# EasyEDA Pro project Loongson_Continuation.epro, board PCB1
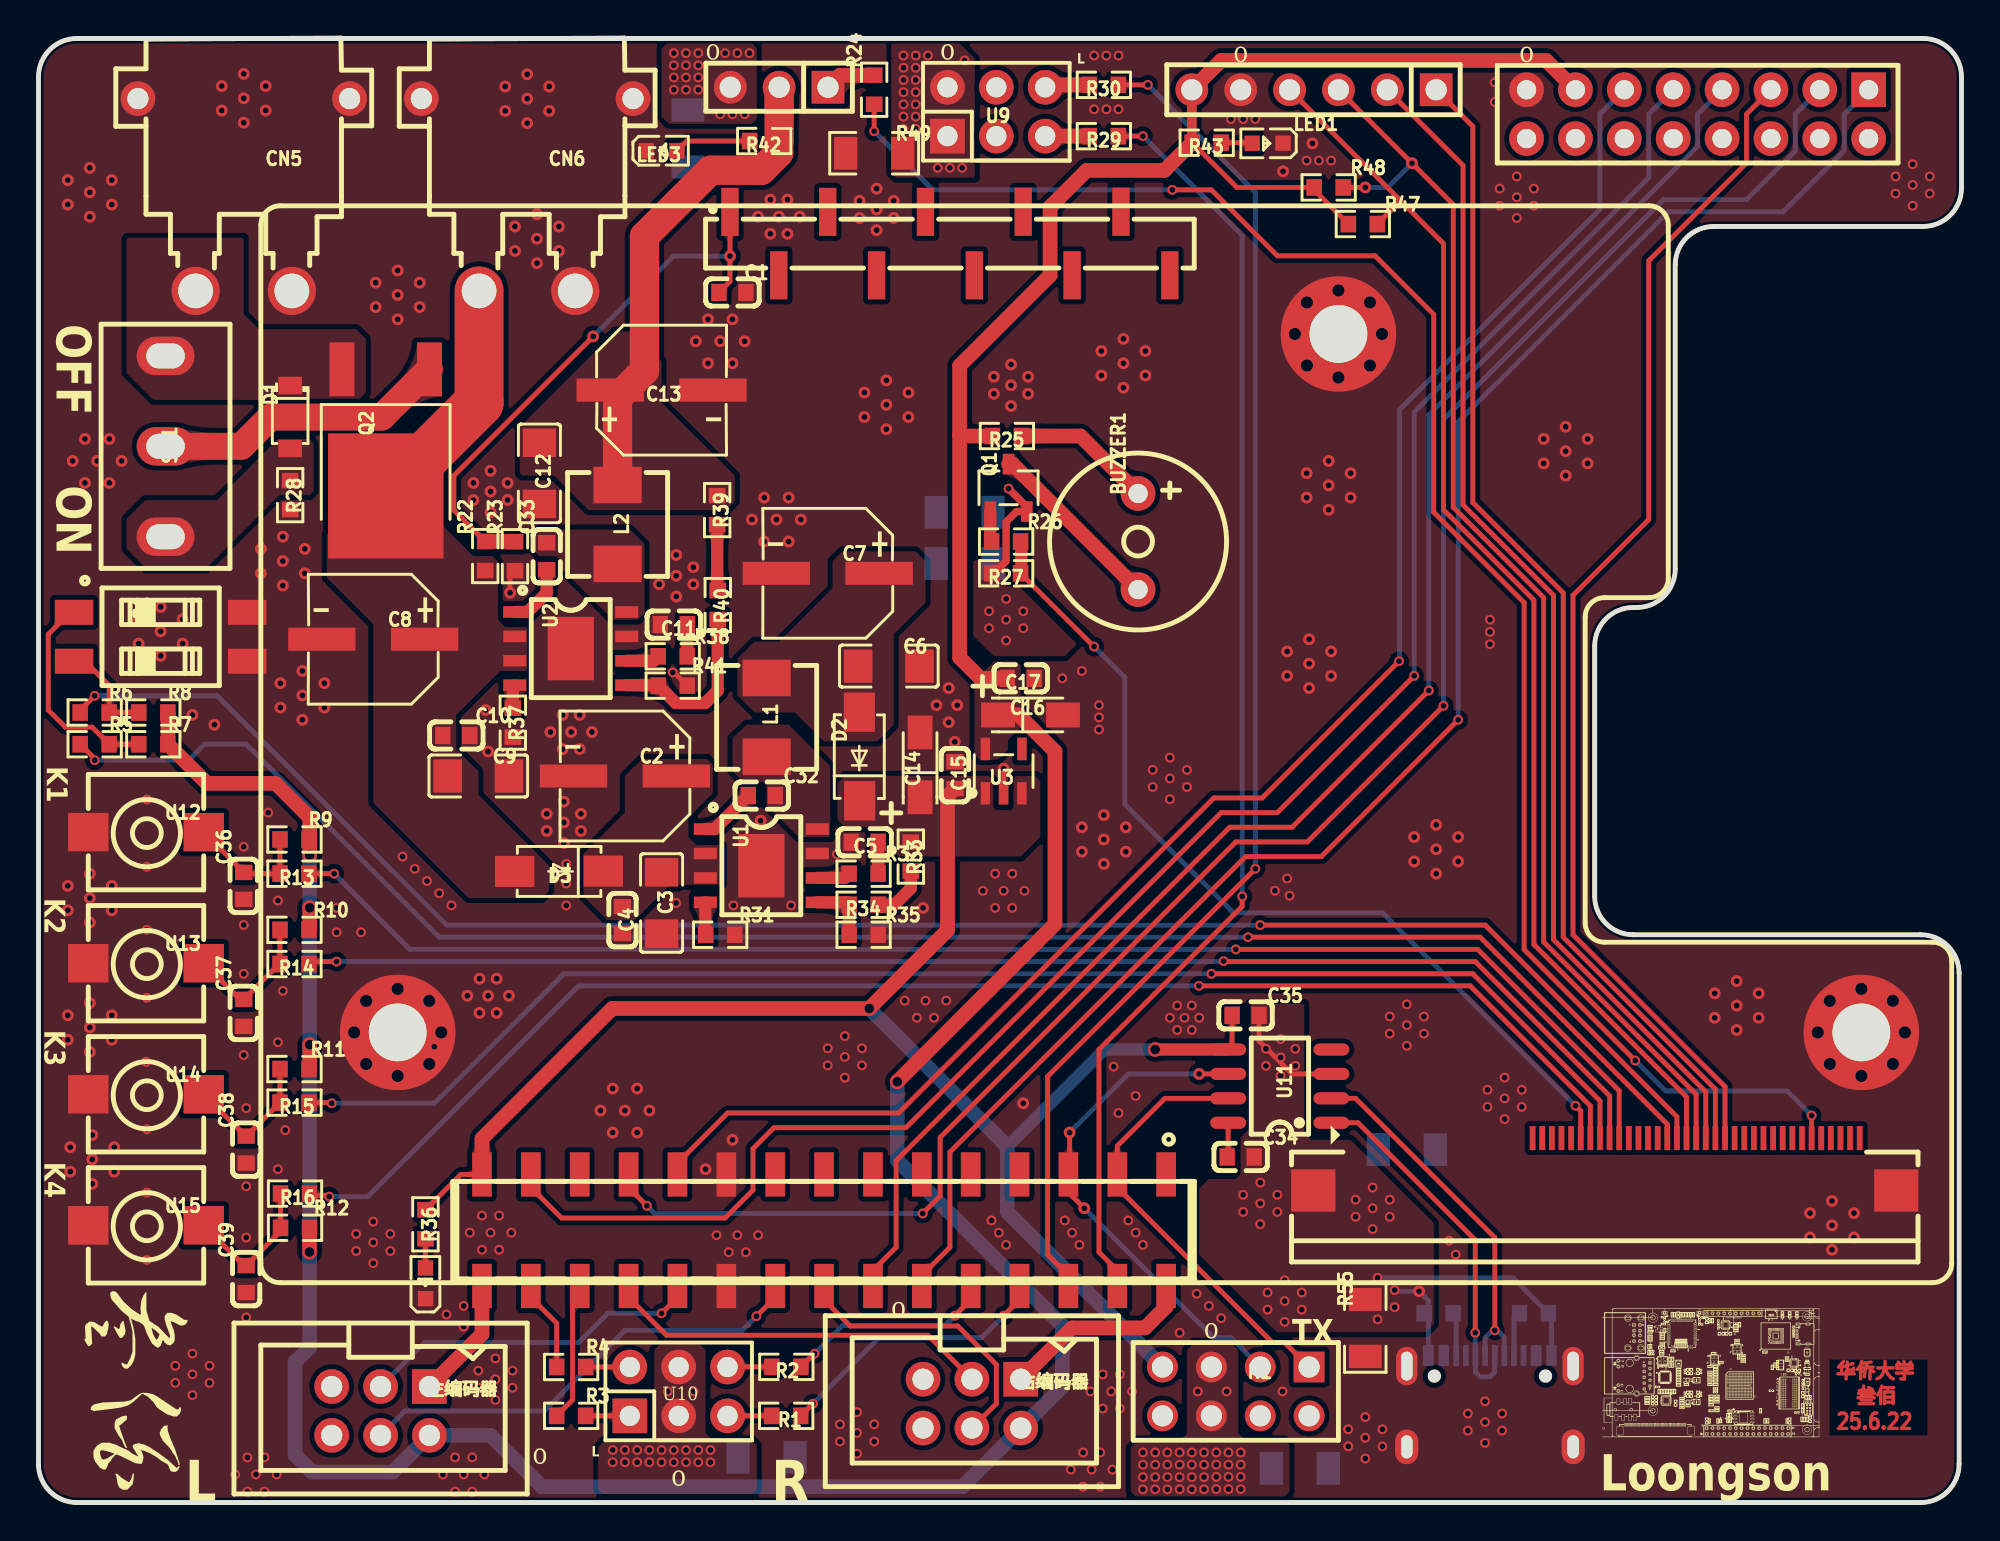
[diagram p2: board, top side]
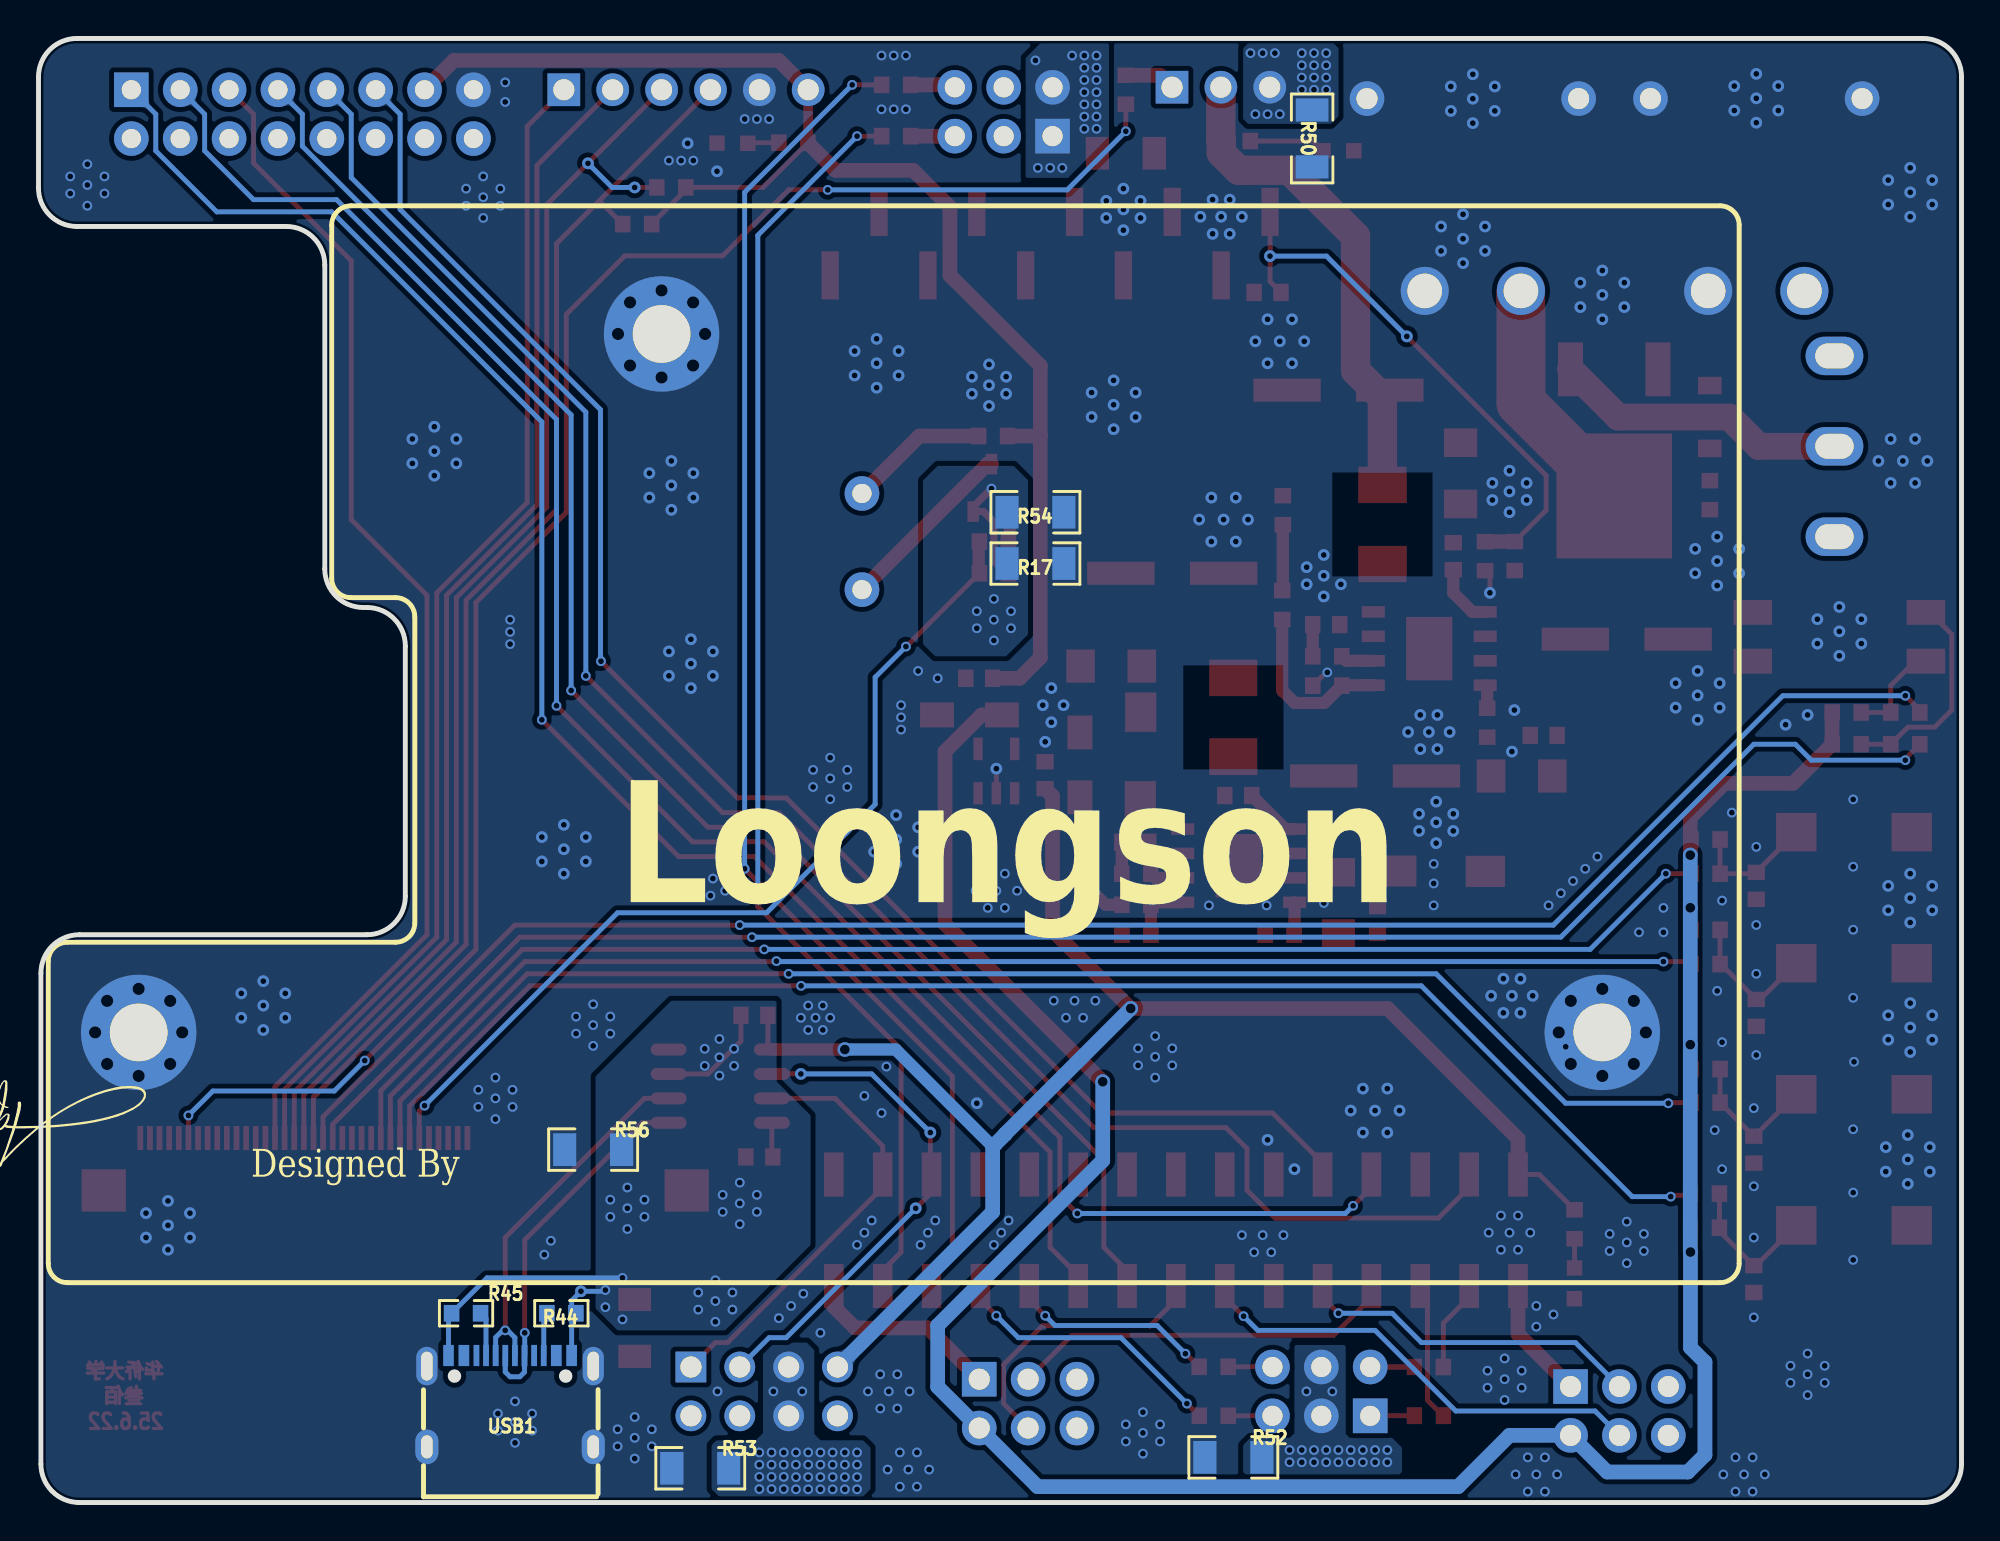
[diagram p3: board, bottom side, seen from below]

Outline 99.95 x 76.14 mm; copper layers: Top Layer, Bottom Layer. Coordinates in mm from the lower left corner of the outline.
Outline path: 0,74.14 arc(0.59,75.55) 2,76.14 97.95,76.14 arc(99.36,75.55) 99.95,74.14 99.95,68.36 arc(99.36,66.95) 97.95,66.36 87.07,66.36 arc(85.65,65.77) 85.07,64.36 85.07,48.55 arc(84.48,47.13) 83.07,46.55 82.88,46.55 arc(81.47,45.96) 80.88,44.55 80.88,31.53 arc(81.47,30.11) 82.88,29.53 97.82,29.53 arc(99.24,28.94) 99.82,27.53 99.82,2 arc(99.24,0.59) 97.82,0 2,0 arc(0.59,0.59) 0,2 0,74.14
Stack: Top Layer 0.035mm / Dielectric1 1.51mm FR4 er 4.5 / Bottom Layer 0.035mm

## Design rules (mm)
template: 自定义配置
spacing copperThickness1oz (default): track to track 0.102, other pairs 0.152 to 0.3
spacing copperThickness2oz: track to track 0.203, other pairs 0.152 to 0.3
track width copperThickness1oz (default): min 0.127, default 0.254, max 2.54
track width copperThickness2oz: min 0.203, default 0.254, max 2.54
differential pair differentialPair (default): width min 0.127, default 0.254, max 2.54; gap min 0.152, default 0.152
via viaSize (default): diameter min 0.5, default 0.61, max 10; hole min 0.3, default 0.305, max 6.3

## Placement (name value [footprint] x y rotation side)
BUZZER1  3kHz  [BUZ-TH_BD9.0-P5.00-D0.6-FD]  57.15 49.98 270 top
C1  100nF  [C0603]  36.07 62.93 180 top
C2  100uF  [CAP-SMD_BD6.3-L6.6-W6.6-LS7.6-FD]  30.48 37.78 180 top
C3  4.7uF  [C1206]  32.39 31.18 90 top
C4  100nF  [C0603]  30.35 30.29 90 top
C5  4.7nF  [C0603]  42.94 34.34 0 top
C6  47uF  [C1206]  44.2 43.5 180 top
C7  220uF  [CAP-SMD_BD6.3-L6.6-W6.6-LS7.4-FD]  41.02 48.32 180 top
C8  100uF  [CAP-SMD_BD6.3-L6.6-W6.6-LS7.6-FD]  17.4 44.9 180 top
C9  4.7uF  [C1206]  22.86 37.78 180 top
C10  100nF  [C0603]  21.72 39.89 180 top
C11  4.7nF  [C0603]  33.02 45.66 0 top
C12  47uF  [C1206]  26.04 53.52 90 top
C13  220uF  [CAP-SMD_BD6.3-L6.6-W6.6-LS7.4-FD]  32.39 57.85 0 top
C14  10uF  [CAP-SMD_L3.2-W1.6-RD-C7171]  45.82 38.36 90 top
C15  100nF  [C0603]  47.64 37.83 90 top
C16  10uF  [CAP-SMD_L3.2-W1.6-RD-C7171]  51.56 40.96 0 top
C17  100nF  [C0603]  51.05 42.86 0 top
C32  100nF  [C0603]  37.59 36.77 180 top
C33  100nF  [C0603]  26.42 49.21 270 top
C34  100nF  [C0603]  62.48 17.97 180 top
C35  100nF  [C0603]  62.74 25.34 180 top
C36  100nF  [C0603]  10.67 32.07 270 top
C37  100nF  [C0603]  10.67 25.46 270 top
C38  100nF  [C0603]  10.8 18.35 270 top
C39  100nF  [C0603]  10.8 11.62 270 top
CH1  HC-PM254-8.5H-2x15PS  [HDR-SMD_30P-P2.54-V-F-R2-C15-LS7.1-1]  40.83 14.16 180 top
CH2  HX PM2.54-1x10P TP-YQ  [HDR-SMD_10P-P2.54-V-F-LS4.7_R2]  47.37 65.47 0 top
CN5  XT30PW-M30.G.Y  [CONN-TH_XT30PW-M]  10.67 68.01 180 top
CN6  XT30PW-M30.G.Y  [CONN-TH_XT30PW-M]  25.4 68.01 180 top
D1  BZT52C16  [SOD-123_L2.7-W1.6-LS3.7-RD]  13.08 56.45 270 top
D2  SS54  [SMA_L4.3-W2.6-LS5.0-FD]  42.67 38.8 270 top
D3  SS54  [SMA_L4.3-W2.6-LS5.0-FD]  27.05 32.83 0 top
H1  PM254V-12-08-H85  [HDR-TH_8P-P2.54-V-F-R2-C4-S2.54]  62.23 5.78 180 top
L1  4.7uH  [IND-SMD_L5.4-W5.2_FXL0530]  37.85 40.83 90 top
L2  4.7uH  [IND-SMD_L5.4-W5.2_FXL0530]  30.1 50.86 90 top
LED1  NCD0603R1  [LED0603-RD_RED]  63.88 70.69 180 top
LED2  NCD0603R1  [LED0603-RD_RED]  20.12 11.4 90 top
LED3  NCD0603B1  [LED0603-RD]  32.39 70.3 0 top
NOREF  -  [Pad_e2196]  67.56 60.77 0 top
NOREF#2  -  [Pad_e2198]  18.67 24.45 0 top
NOREF#3  -  [Pad_e2197]  94.74 24.45 0 top
Q1  S8050  [SOT-23-3_L2.9-W1.6-P1.90-LS2.8-BR]  50.42 52.77 270 top
Q2  HY19P03D  [TO-252-2_L6.6-W6.1-P4.57-LS9.9-TL-CW]  18.05 55.64 270 top
R1  100Ω  [R0603]  38.86 4.51 0 top
R2  100Ω  [R0603]  38.87 7.06 0 top
R3  100Ω  [R0603]  27.69 4.51 180 top
R4  100Ω  [R0603]  27.69 7.05 180 top
R5  470Ω  [R0603]  2.92 39.43 180 top
R6  470Ω  [R0603]  2.92 41.09 180 top
R7  4.7kΩ  [R0603]  5.97 39.43 180 top
R8  4.7kΩ  [R0603]  5.97 41.09 180 top
R9  4.7kΩ  [R0603]  13.31 34.48 180 top
R10  4.7kΩ  [R0603]  13.31 29.78 180 top
R11  4.7kΩ  [R0603]  13.31 22.54 180 top
R12  4.7kΩ  [R0603]  13.34 14.29 180 top
R13  100Ω  [R0603]  13.31 32.7 0 top
R14  100Ω  [R0603]  13.31 28 0 top
R15  100Ω  [R0603]  13.31 20.8 0 top
R16  100Ω  [R0603]  13.34 16.07 0 top
R17  0Ω  [R1206]  48.13 48.83 180 bottom
R22  200kΩ  [R0603]  23.22 49.22 270 top
R23  20kΩ  [R0603]  24.77 49.21 270 top
R24  100Ω  [R0603]  43.43 73.47 270 top
R25  10Ω  [R0603]  50.33 55.46 0 top
R26  4.7kΩ  [R0603]  50.29 49.98 180 top
R27  10kΩ  [R0603]  50.29 48.32 0 top
R28  10kΩ  [R0603]  13.08 52.39 90 top
R29  100Ω  [R0603]  55.37 71.06 0 top
R30  100Ω  [R0603]  55.37 73.72 0 top
R31  200kΩ  [R0603]  35.43 29.53 180 top
R32  20kΩ  [R0603]  42.89 32.7 180 top
R33  51kΩ  [R0603]  45.34 33.59 90 top
R34  1.5kΩ  [R0603]  42.89 31.09 0 top
R35  10kΩ  [R0603]  42.89 29.53 180 top
R36  4.7kΩ  [R0603]  20.11 14.47 90 top
R37  200kΩ  [R0603]  24.65 40.56 90 top
R38  20kΩ  [R0603]  32.96 44.01 180 top
R39  27kΩ  [R0603]  35.27 51.61 90 top
R40  27kΩ  [R0603]  35.31 46.67 90 top
R41  7.5kΩ  [R0603]  32.96 42.48 180 top
R42  10kΩ  [R0603]  37.72 70.8 0 top
R43  2.7kΩ  [R0603]  60.72 70.72 0 top
R44  5.1kΩ  [R0603]  72.77 9.84 180 bottom
R45  5.1kΩ  [R0603]  77.72 9.84 0 bottom
R47  4.7kΩ  [R0603]  68.83 66.49 180 top
R48  4.7kΩ  [R0603]  67.06 68.39 180 top
R49  0Ω  [R1206]  43.43 70.17 180 top
R50  0Ω  [R1206]  33.75 70.94 270 bottom
R52  0Ω  [R1206]  37.85 2.35 0 bottom
R53  0Ω  [R1206]  65.55 1.78 0 bottom
R54  0Ω  [R1206]  48.13 51.5 180 bottom
R55  0Ω  [R1206]  68.96 9.08 270 top
R56  0Ω  [R1206]  71.12 18.35 0 bottom
S1  DSIC02LS-P  [SW-SMD_4P-L5.1-W6.1-P2.54-LS9.8]  6.35 45.02 270 top
SW1  SS-12D10L5  [SW-TH_SS-12D10L5]  6.6 54.93 90 top
U1  SCT2450STER  [ESOP-8_L4.9-W3.9-P1.27-LS6.0-BL-EP]  37.57 33.12 270 top
U2  SCT2450STER  [ESOP-8_L4.9-W3.9-P1.27-LS6.0-BL-EP]  27.66 44.41 270 top
U3  RT9013-33GB  [SOT-23-5_L3.0-W1.7-P0.95-LS2.8-BL]  50.17 38.04 0 top
U8  AFD01-S54FCC-00  [FPC-SMD_54P-P0.50_AFD01-S54FCA-00]  81.41 17.59 180 top
U9  ZX-PZ2.54-2-3PZZ  [HDR-TH_6P-P2.54-V-M-R2-C3-S2.54-1]  49.78 72.33 0 top
U10  ZX-PZ2.54-2-3PZZ  [HDR-TH_6P-P2.54-V-M-R2-C3-S2.54-1]  33.27 5.78 0 top
U11  CH340N  [SOP-8_L4.9-W3.9-P1.27-LS6.0-BL]  64.52 21.65 90 top
U12  SKPMAQE010  [KEY-SMD_2P-L6.0-W6.0-P6.00]  5.59 34.86 180 top
U13  SKPMAQE010  [KEY-SMD_2P-L6.0-W6.0-P6.00]  5.59 28.05 180 top
U14  SKPMAQE010  [KEY-SMD_2P-L6.0-W6.0-P6.00]  5.59 21.23 180 top
U15  SKPMAQE010  [KEY-SMD_2P-L6.0-W6.0-P6.00]  5.59 14.42 180 top
USB1  TYPE-C 16PIN 2MD(073)  [USB-C-SMD_TYPE-C-6PIN-2MD-073]  75.44 5.27 180 bottom
右编码器  BH254V-6P  [IDC-TH_6P-P2.54-V-R2-C3-S2.54]  48.51 5.14 180 top
屏幕1  PM254-2-08-Z-8.5  [HDR-TH_16P-P2.54-V-F-R2-C8-S2.54]  86.23 72.2 180 top
左编码器  BH254V-6P  [IDC-TH_6P-P2.54-V-R2-C3-S2.54]  17.78 4.76 180 top
舵机1  PZ254V-11-03P  [HDR-TH_3P-P2.54-V-M]  38.49 73.6 180 top
陀螺仪1  PZ254V-11-06P  [HDR-TH_6P-P2.54-V-M]  66.29 73.47 180 top

## Footprints (pads in the part's own frame, mm; a bottom-side part is the same pattern mirrored in y, then rotated)
BUZ-TH_BD9.0-P5.00-D0.6-FD
  round 1.8 hole 1: 1(-2.5,0) 2(2.5,0)
C0603
  rect 0.8x0.9 smd: 1(-0.7,0) 2(0.7,0)
C1206
  rect 1.485x1.728 smd: 1(-1.593,0) 2(1.593,0)
CAP-SMD_BD6.3-L6.6-W6.6-LS7.4-FD
  rect 3.5x1.2 smd: 1(-2.67,0) 2(2.67,0)
CAP-SMD_BD6.3-L6.6-W6.6-LS7.6-FD
  rect 3.5x1.2 smd: 1(-2.67,0) 2(2.67,0)
CAP-SMD_L3.2-W1.6-RD-C7171
  rect 1.758x1.296 smd: 1(-1.687,0) 2(1.687,0)
CONN-TH_XT30PW-M
  round 2.5 hole 1.8: 1(-2.5,5) 2(2.5,5)
  round 1.8 hole 1.1: 3(5.5,-5) 4(-5.5,-5)
ESOP-8_L4.9-W3.9-P1.27-LS6.0-BL-EP
  rect 0.6x1.2 smd: 1(-1.905,-2.909) 2(-0.635,-2.909) 3(0.635,-2.909) 4(1.905,-2.909) 5(1.905,2.909) 6(0.635,2.909) 7(-0.635,2.909) 8(-1.905,2.909)
  rect 3.3x2.4 smd: 9(0,0)
FPC-SMD_54P-P0.50_AFD01-S54FCA-00
  rect 0.3x1.25 smd: 20(3.75,-1.363) 21(3.25,-1.363) 22(2.75,-1.363) 23(2.25,-1.363) 24(1.75,-1.363) 25(1.25,-1.363) 26(0.75,-1.363) 27(0.25,-1.363) 28(-0.25,-1.363) 29(-0.75,-1.363) 30(-1.25,-1.363) 31(-1.75,-1.363) 32(-2.25,-1.363) 33(-2.75,-1.363) 34(-3.25,-1.363) 35(-3.75,-1.363) 36(-4.25,-1.363) 37(-4.75,-1.363) 38(-5.25,-1.363) 39(-5.75,-1.363) 40(-6.25,-1.363) 41(-6.75,-1.363) 42(-7.25,-1.363) 43(-7.75,-1.363) 44(-8.25,-1.363) 45(-8.75,-1.363) 46(-9.25,-1.363) 47(-9.75,-1.363) 48(-10.25,-1.363) 49(-10.75,-1.363) 50(-11.25,-1.363) 51(-11.75,-1.363) 52(-12.25,-1.363) 53(-12.75,-1.363) 54(-13.25,-1.363)
  rect 2.3x2.2 smd: 55(-15.15,1.363) 56(15.15,1.363)
HDR-SMD_10P-P2.54-V-F-LS4.7_R2
  rect 0.9x2.5 smd: 1(-11.43,1.65) 2(-8.89,-1.65) 3(-6.35,1.65) 4(-3.81,-1.65) 5(-1.27,1.65) 6(1.27,-1.65) 7(3.81,1.65) 8(6.35,-1.65) 9(8.89,1.65) 10(11.43,-1.65)
HDR-SMD_30P-P2.54-V-F-R2-C15-LS7.1-1
  rect 1.02x2.3 smd: 1(-17.78,-2.9) 2(-17.78,2.9) 3(-15.24,-2.9) 4(-15.24,2.9) 5(-12.7,-2.9) 6(-12.7,2.9) 7(-10.16,-2.9) 8(-10.16,2.9) 9(-7.62,-2.9) 10(-7.62,2.9) 11(-5.08,-2.9) 12(-5.08,2.9) 13(-2.54,-2.9) 14(-2.54,2.9) 15(0,-2.9) 16(0,2.9) 17(2.54,-2.9) 18(2.54,2.9) 19(5.08,-2.9) 20(5.08,2.9) 21(7.62,-2.9) 22(7.62,2.9) 23(10.16,-2.9) 24(10.16,2.9) 25(12.7,-2.9) 26(12.7,2.9) 27(15.24,-2.9) 28(15.24,2.9) 29(17.78,-2.9) 30(17.78,2.9)
HDR-TH_3P-P2.54-V-M
  rect 1.7x1.7 hole 1.1: 1(-2.54,0)
  round 1.7 hole 1.1: 2(0,0) 3(2.54,0)
HDR-TH_6P-P2.54-V-M
  rect 1.7x1.7 hole 1.1: 1(-6.35,0)
  round 1.7 hole 1.1: 2(-3.81,0) 3(-1.27,0) 4(1.27,0) 5(3.81,0) 6(6.35,0)
HDR-TH_6P-P2.54-V-M-R2-C3-S2.54-1
  rect 1.8x1.8 hole 1.05: 1(-2.54,-1.27)
  round 1.8 hole 1.05: 2(-2.54,1.27) 3(0,-1.27) 4(0,1.27) 5(2.54,-1.27) 6(2.54,1.27)
HDR-TH_8P-P2.54-V-F-R2-C4-S2.54
  rect 1.6x1.6 hole 1.1: 1(-3.81,-1.27)
  round 1.6 hole 1.1: 2(-3.81,1.27) 3(-1.27,-1.27) 4(-1.27,1.27) 5(1.27,-1.27) 6(1.27,1.27) 7(3.81,-1.27) 8(3.81,1.27)
HDR-TH_16P-P2.54-V-F-R2-C8-S2.54
  rect 1.8x1.8 hole 1: 1(-8.89,-1.27)
  round 1.8 hole 1: 2(-8.89,1.27) 3(-6.35,-1.27) 4(-6.35,1.27) 5(-3.81,-1.27) 6(-3.81,1.27) 7(-1.27,-1.27) 8(-1.27,1.27) 9(1.27,-1.27) 10(1.27,1.27) 11(3.81,-1.27) 12(3.81,1.27) 13(6.35,-1.27) 14(6.35,1.27) 15(8.89,-1.27) 16(8.89,1.27)
IDC-TH_6P-P2.54-V-R2-C3-S2.54
  rect 1.8x1.8 hole 1.1: 1(-2.54,-1.27)
  round 1.8 hole 1.1: 2(-2.54,1.27) 3(0,-1.27) 4(0,1.27) 5(2.54,-1.27) 6(2.54,1.27)
IND-SMD_L5.4-W5.2_FXL0530
  rect 1.9x2.5 smd: 1(-2.05,0) 2(2.05,0)
KEY-SMD_2P-L6.0-W6.0-P6.00
  rect 2.1x2 smd: 1(-3,0) 2(3,0)
LED0603-RD
  rect 0.8x0.8 smd: 1(-0.799,0) 2(0.799,0)
LED0603-RD_RED
  rect 0.8x0.8 smd: 1(-0.799,-0.004) 2(0.799,0.004)
Pad_e2196
  round 6 hole 3: 1(0,0)
Pad_e2197
  round 6 hole 3: 1(0,0)
Pad_e2198
  round 6 hole 3: 1(0,0)
R0603
  rect 0.806x0.864 smd: 1(-0.753,0) 2(0.753,0)
R1206
  rect 1.208x1.701 smd: 1(-1.479,0) 2(1.479,0)
SMA_L4.3-W2.6-LS5.0-FD
  rect 2.046x1.62 smd: 1(-2.304,-0.009) 2(2.304,0.009)
SOD-123_L2.7-W1.6-LS3.7-RD
  rect 0.91x1.22 smd: 1(-1.635,0) 2(1.635,0)
SOP-8_L4.9-W3.9-P1.27-LS6.0-BL
  oval 0.63x1.865 smd: 1(-1.905,-2.683) 2(-0.635,-2.683) 3(0.635,-2.683) 4(1.905,-2.683) 5(1.905,2.683) 6(0.635,2.683) 7(-0.635,2.683) 8(-1.905,2.683)
SOT-23-3_L2.9-W1.6-P1.90-LS2.8-BR
  rect 1.07x0.6 smd: 1(1.235,-0.95) 2(1.235,0.95) 3(-1.235,0)
SOT-23-5_L3.0-W1.7-P0.95-LS2.8-BL
  rect 0.49x1.157 smd: 1(-0.95,-1.153) 2(0,-1.153) 3(0.95,-1.153)
  rect 0.49x1.175 smd: 4(0.95,1.153) 5(-0.95,1.153)
SW-SMD_4P-L5.1-W6.1-P2.54-LS9.8
  rect 1.3x2 smd: 1(-1.27,-4.5) 2(1.27,-4.5) 3(1.27,4.5) 4(-1.27,4.5)
SW-TH_SS-12D10L5
  oval 2x3 hole 1.3x2: 1(-4.7,0) 2(0,0) 3(4.7,0)
TO-252-2_L6.6-W6.1-P4.57-LS9.9-TL-CW
  rect 2.8x1.3 smd: 1(-3.292,2.273) 3(-3.292,-2.273)
  rect 6.5x6 smd: 2(3.292,0)
USB-C-SMD_TYPE-C-6PIN-2MD-073
  rect 0.55x1.1 smd: 1(-3.2,2.375) 2(-2.4,2.375) 11(2.4,2.375) 12(3.2,2.375)
  rect 0.3x1.1 smd: 3(-1.75,2.375) 4(-1.25,2.375) 5(-0.75,2.375) 6(-0.25,2.375) 7(0.25,2.375) 8(0.75,2.375) 9(1.25,2.375) 10(1.75,2.375)
  oval 1.2x1.8 hole 0.6x1.2: 13(-4.325,-2.375) 14(4.325,-2.375)
  oval 1.1x2 hole 0.6x1.5: 13(-4.325,1.825) 14(4.325,1.825)

## Nets
As in the schematic, except:
GND: C1.1 C2.2 C3.1 C4.1 C5.1 C6.1 C7.2 C8.2 C9.1 C10.1 C11.1 C12.1 C13.2 C14.2 C15.2 C16.2 C17.2 C36.2 C37.2 C38.2 C39.2 CH1.19 CH1.20 CN5.1 CN5.3 CN5.4 CN6.1 CN6.3 CN6.4 LED1.1 LED2.1 LED3.1 NOREF.1 NOREF#2.1 NOREF#3.1 R17.2 R23.2 R28.1 R31.1 R35.1 R37.1 R41.1 R49.2 R50.2 R52.2 R53.2 R54.2 R55.2 R56.2 S1.3 S1.4 U1.7 U1.9 U2.7 U2.9 U3.2 U8.55 U12.2 U13.2 U14.2 U15.2 USB1.13 USB1.14 屏幕1.15 陀螺仪1.5

Pads without a net: CH1 1 7 9 11 13 15 17 25; CH2 2 3 4 5 6 7 8 9 10; H1 2 4 8; U3 4; U8 20 21 22 23 24 30 31 32 33 41 42 43 44 45 46 47 48 50 51 52 53 54; U9 3 4; U11 4; USB1 2 3 9 11; 右编码器 5 6; 屏幕1 2 4 6 8 10 12 14 16; 左编码器 5 6

## Via types
v1: diameter 0.762, hole 0.508, Top Layer to Bottom Layer, 7 vias
v2: diameter 0.889, hole 0.635, Top Layer to Bottom Layer, 24 vias
v3: diameter 0.508, hole 0.305, Top Layer to Bottom Layer, 401 vias
v4: diameter 0.61, hole 0.305, Top Layer to Bottom Layer, 249 vias

## Routing (per net, layer and track width the routed paths; a pad name or vN(x,y) marks a point on that pad's centre or on a via; arc(x,y) is an arc through that point)
3V3: length 207.9
  Top Layer w0.254: R43.1 62.29,68.39 R48.2 66.3,68.26 R47.2
  Top Layer w0.508: R43.1 59.94,70.73 陀螺仪1.6
  Top Layer w0.762: R43.1 58.53,69.28 54.48,69.28 52.58,67.37 52.58,63.82 47.88,59.12 47.88,55.51 ; C16.1 50.93,40.96 52.83,39.06 52.83,30.08 v1(44.63,21.88) ; R8.1 6.73,41.08 6.73,39.94 ; R10.1 14.1,29.82 v1(14.1,30.93) ; v1(14.09,13.03) R12.1 ; R11.1 14.1,22.58 v1(14.1,23.81) ; 47.88,55.51 47.88,43.94 48.95,42.86 C17.1 ; 47.88,55.51 47.93,55.46 R25.1 ; R7.1 8.75,37.4 12.32,37.4 14.1,35.62 14.1,33.72 ; 陀螺仪1.6 61.47,74.99 78.36,74.99 屏幕1.13
  Bottom Layer w0.762: v1(14.1,33.67) v1(14.1,30.93) v1(14.1,23.81) 14.1,13.04 v1(14.09,13.03) 14.09,8.06 13.34,7.3 13.34,2.48 14.22,1.59 18.42,1.59 左编码器.2 23.5,3.49 26.16,0.83 48.02,0.83 53.21,6.02 53.21,9.21 44.63,17.79 v1(44.63,21.88)
+5V: length 82.2
  Top Layer w0.254: U11.5 62.04,23.76 C35.2 ; R36.2 21.95,17.06 CH1.29
  Top Layer w0.635: U11.5 v1(58.04,23.56)
  Top Layer w0.762: CH1.29 23.05,18.92 29.82,25.69 v1(43.18,25.69) 47.24,29.76 47.24,36.73 C15.1
  Bottom Layer w0.635: 50.36,18.52 55.4,23.56 v1(58.04,23.56)
  Bottom Layer w0.762: H1.7 50.36,15.11 50.36,18.52 50.22,18.66 50.2,18.66 49.71,19.15 49.71,19.17 v1(43.18,25.69)
AGND: length 22.5
  Top Layer w0.254: U11.3 65.15,22.29 63.44,24 C35.1
  Bottom Layer w0.254: v3(70.48,11.05) 70.55,10.99 v4(71.76,10.99) 72.24,10.5 USB1.12 ; v3(69.6,11.68) 76.64,11.68 R45.2 78.64,9.68 USB1.1
  vias: v3(62.61,16) v3(62.61,15.11) v3(63.5,16.64) v3(63.5,15.56) v3(63.5,14.48) v3(63.8,23.6) v3(63.8,22.71) v3(63.88,10.92) v3(63.88,10.03) v3(64.39,16) v3(64.39,15.11) v3(64.56,24.11) v3(64.56,23.15) v3(64.56,22.2) v3(64.77,11.56) v3(64.77,10.48) v3(64.77,9.4) v3(65.32,23.6) v3(65.32,22.71) v3(65.66,10.92) v3(65.66,10.03) v3(68.45,15.75) v3(68.45,14.86) v3(69.34,16.38) v3(69.34,15.3) v3(69.34,14.22) v3(69.6,9.53) v3(70.23,15.75) v3(70.23,14.86) v3(70.48,10.16)
DGND: length 6.4
  Top Layer w0.762: CH1.30 23.05,8.76 左编码器.1
GND: length 3.6
  Top Layer w0.254: v3(32.96,43.17) 33.03,43.17 R41.1 ; U3.2 v4(50.17,38.16) ; R23.2 24.51,48.21 v4(24.51,47.31)
  vias: v2(16.41,24.45) v2(17.03,26.09) v2(17.03,22.81) v2(18.67,26.71) v2(18.67,22.19) v2(20.31,26.09) v2(20.31,22.81) v2(20.93,24.45) v2(65.3,60.77) v2(65.93,62.41) v2(65.93,59.13) v2(67.57,63.03) v2(67.57,58.51) v2(69.2,62.41) v2(69.2,59.13) v2(69.83,60.77) v2(92.48,24.45) v2(93.1,26.09) v2(93.11,22.81) v2(94.74,26.71) v2(94.74,22.19) v2(96.38,26.09) v2(96.38,22.81) v2(97.01,24.45) v3(5.59,22.92) v3(5.63,36.56) v3(5.63,33.06) v3(5.63,29.79) v3(5.63,26.25) v3(5.63,19.41) v3(5.63,16.12) v3(5.63,12.62) v3(7.11,7.11) v3(7.11,6.22) v3(8,7.75) v3(8,6.67) v3(8,5.59) v3(8.89,7.11) v3(8.89,6.22) v3(10.22,1.46) v3(10.67,34.1) v3(10.67,30.04) v3(10.67,27.5) v3(10.67,23.27) v3(10.8,20.51) v3(10.8,16.45) v3(10.8,13.78) v3(10.8,9.63) v3(10.86,2.35) v3(10.86,0.57) v3(11.3,1.46) v3(11.75,2.35) v3(11.75,0.57) v3(11.94,35.88) v3(12.38,1.46) v3(12.45,31.31) v3(12.45,23.94) v3(12.45,17.34) v3(12.7,26.61) v3(12.83,19.37) v3(15.49,30.93) v3(15.49,29.66) v3(16.51,13.97) v3(16.51,13.08) v3(16.76,29.66) v3(17.4,14.61) v3(17.4,13.53) v3(17.4,12.45) v3(18.29,13.97) v3(18.29,13.08) v3(18.92,33.59) v3(19.56,32.96) v3(20.19,32.32) v3(20.57,23.7) v3(20.83,31.69) v3(21.02,1.46) v3(21.21,9.78) v3(21.46,31.05) v3(21.65,2.35) v3(21.65,0.57) v3(22.1,10.22) v3(22.1,9.14) v3(22.1,1.46) v3(22.42,14.03) v3(22.54,2.35) v3(22.54,0.57) v3(22.86,6.86) v3(22.86,5.97) v3(23.05,14.92) v3(23.05,13.15) v3(23.18,1.46) v3(23.5,14.03) v3(23.75,7.49) v3(23.75,6.41) v3(23.75,5.33) v3(23.94,14.92) v3(23.94,13.15) v3(24.57,14.03) v3(24.64,6.86) v3(24.64,5.97) v3(27.43,33.21) v3(27.43,32.2) v3(27.43,31.05) v3(33.14,31.18) v3(35.24,13.91) v3(35.88,13.02) v3(36.12,31.05) v3(36.32,13.91) v3(36.77,13.02) v3(37.4,13.91) v3(39.12,31.05) v3(41.02,23.62) v3(41.02,22.73) v3(41.5,33.72) v3(41.66,4.06) v3(41.66,3.18) v3(41.91,24.26) v3(41.91,23.18) v3(41.91,22.1) v3(42.55,4.7) v3(42.55,3.62) v3(42.55,2.54) v3(42.8,23.62) v3(42.8,22.73) v3(43.43,4.06) v3(43.43,3.18) v3(45.02,26.1) v3(45.66,25.21) v3(46.1,26.1) v3(46.55,25.21) v3(47.18,26.1) v3(49.09,31.81) v3(49.53,14.67) v3(49.72,32.7) v3(49.72,30.93) v3(49.91,14.03) v3(50.17,31.81) v3(50.29,13.4) v3(50.61,32.7) v3(50.61,30.93) v3(51.24,31.81) v3(53.21,42.86) v3(53.34,14.67) v3(53.72,14.03) v3(53.66,1.72) v3(54.1,13.4) v3(54.23,43.24) v3(54.29,2.6) v3(54.29,0.83) v3(54.68,5.78) v3(54.74,1.72) v3(54.86,75.25) v3(54.86,72.45) v3(55.12,41.47) v3(55.12,40.83) v3(55.12,40.2) v3(55.18,2.6) v3(55.18,0.83) v3(55.31,6.67) v3(55.31,4.89) v3(55.5,75.25) v3(55.5,72.45) v3(55.76,5.78) v3(55.82,1.72) v3(55.88,22.67) v3(56.13,75.25) v3(56.13,72.45) v3(56.13,20.26) v3(56.2,6.67) v3(56.2,4.89) v3(56.64,14.67) v3(56.84,5.78) v3(57.02,21.15) v3(57.02,14.03) v3(57.4,13.4) v3(57.91,38.1) v3(57.91,37.21) v3(58.8,38.74) v3(58.8,37.66) v3(58.8,36.58) v3(58.8,25.21) v3(59.18,25.85) v3(59.18,24.58) v3(59.31,8.83) v3(59.56,25.21) v3(59.69,38.1) v3(59.69,37.21) v3(59.94,25.85) v3(59.94,24.58) v3(60.2,10.86) v3(60.33,25.21) v3(60.83,10.22) v3(61.47,9.59) v3(61.98,71.95) v3(62.61,71.95) v3(63.25,71.95) v3(64.26,31.81) v3(64.66,5.78) v3(64.9,32.45) v3(65.02,31.56) v3(65.91,69.79) v3(66.55,69.79) v3(67.18,69.79) v3(68.07,3.81) v3(68.07,2.92) v3(68.96,4.45) v3(68.96,3.37) v3(68.96,2.29) v3(69.85,3.81) v3(69.85,2.92) v3(70.23,25.27) v3(70.23,24.38) v3(71.12,25.91) v3(71.12,24.83) v3(71.12,23.75) v3(72.01,25.27) v3(72.01,24.38) v3(73.32,13.61) v3(73.66,12.89) v3(74.29,4.63) v3(74.29,3.74) v3(75.18,5.26) v3(75.18,4.18) v3(75.18,3.1) v3(75.31,21.46) v3(75.31,20.57) v3(75.44,45.91) v3(75.44,45.28) v3(75.44,44.64) v3(75.69,73.85) v3(75.69,72.84) v3(75.95,68.33) v3(75.95,67.44) v3(76.07,4.63) v3(76.07,3.74) v3(76.2,22.1) v3(76.2,21.02) v3(76.2,19.94) v3(76.83,68.96) v3(76.83,67.88) v3(76.83,66.8) v3(77.09,21.46) v3(77.09,20.57) v3(77.72,68.33) v3(77.72,67.44) v3(96.52,68.96) v3(96.52,68.07) v3(97.41,69.6) v3(97.41,68.52) v3(97.41,67.44) v3(98.3,68.96) v3(98.3,68.07) v4(1.52,68.77) v4(1.52,67.5) v4(1.52,32.07) v4(1.52,30.8) v4(1.52,25.34) v4(1.52,24.07) v4(1.65,18.48) v4(1.65,17.21) v4(1.78,54.17) v4(2.41,55.31) v4(2.41,53.02) v4(2.67,69.41) v4(2.67,68.14) v4(2.67,66.87) v4(2.67,32.7) v4(2.67,31.43) v4(2.67,30.16) v4(2.67,25.97) v4(2.67,24.7) v4(2.67,23.43) v4(2.79,19.11) v4(2.79,17.84) v4(2.79,16.57) v4(3.05,54.17) v4(3.68,55.31) v4(3.68,53.02) v4(3.81,68.77) v4(3.81,67.5) v4(3.81,32.07) v4(3.81,30.8) v4(3.81,25.34) v4(3.81,24.07) v4(3.94,18.48) v4(3.94,17.21) v4(4.32,54.17) v4(5.21,45.94) v4(5.21,44.67) v4(6.35,46.57) v4(6.35,45.3) v4(6.35,44.03) v4(7.49,45.94) v4(7.49,44.67) v4(8,40.96) v4(9.14,40.45) v4(9.53,73.66) v4(9.53,72.39) v4(10.67,74.3) v4(10.67,73.03) v4(10.67,71.76) v4(11.56,49.59) v4(11.56,48.32) v4(11.81,73.66) v4(11.81,72.39) v4(12.57,42.61) v4(12.57,41.34) v4(12.7,50.23) v4(12.7,48.96) v4(12.7,47.69) v4(13.72,43.24) v4(13.72,41.97) v4(13.72,40.7) v4(13.84,49.59) v4(13.84,48.32) v4(14.86,42.61) v4(14.86,41.34) v4(17.53,63.44) v4(17.53,62.17) v4(18.67,64.07) v4(18.67,62.8) v4(18.67,61.53) v4(19.81,63.44) v4(19.81,62.17) v4(22.29,26.35) v4(22.61,53.02) v4(22.61,52.13) v4(22.92,27.24) v4(22.92,25.46) v4(23.24,41.21) v4(23.37,39.05) v4(23.37,26.35) v4(23.5,53.66) v4(23.5,52.58) v4(23.5,51.5) v4(23.81,27.24) v4(23.81,25.46) v4(24.26,73.64) v4(24.26,72.37) v4(24.38,53.02) v4(24.38,52.13) v4(24.45,26.35) v4(24.77,66.36) v4(24.77,65.09) v4(25.4,74.27) v4(25.4,73) v4(25.4,71.73) v4(25.91,66.99) v4(25.91,65.72) v4(25.91,64.45) v4(26.42,35.81) v4(26.42,34.93) v4(26.54,73.64) v4(26.54,72.37) v4(26.61,40.07) v4(27.05,66.36) v4(27.05,65.09) v4(27.24,40.96) v4(27.24,39.18) v4(27.31,36.45) v4(27.31,35.37) v4(27.31,34.29) v4(27.69,40.07) v4(28.13,40.96) v4(28.13,39.18) v4(28.19,35.81) v4(28.19,34.93) v4(28.77,40.07) v4(29.21,20.38) v4(29.84,21.53) v4(29.84,19.24) v4(30.48,20.38) v4(31.12,21.53) v4(31.12,19.24) v4(31.75,20.38) v4(32.26,47.75) v4(33.15,49.28) v4(33.15,48.2) v4(33.15,47.12) v4(34.04,48.64) v4(34.04,47.75) v4(34.16,60.39) v4(34.67,17.34) v4(34.8,61.53) v4(34.8,59.25) v4(35.43,60.39) v4(36.07,61.53) v4(36.07,59.25) v4(36.07,18.86) v4(36.7,60.39) v4(37.08,51.12) v4(37.4,66.87) v4(37.54,35.46) v4(37.72,52.26) v4(37.72,49.98) v4(38.04,67.76) v4(38.04,65.98) v4(38.35,51.12) v4(38.48,66.87) v4(38.93,67.76) v4(38.93,65.98) v4(38.99,52.26) v4(38.99,49.98) v4(39.56,66.87) v4(39.62,51.12) v4(42.67,67.69) v4(42.67,66.8) v4(42.93,57.72) v4(42.93,56.45) v4(43.56,68.33) v4(43.56,67.25) v4(43.56,66.17) v4(44.07,58.36) v4(44.07,57.09) v4(44.07,55.82) v4(44.45,67.69) v4(44.45,66.8) v4(45.21,57.72) v4(45.21,56.45) v4(45.97,30.93) v4(46.67,41.47) v4(47.31,42.36) v4(47.31,40.58) v4(47.63,39.56) v4(47.75,41.47) v4(49.66,58.55) v4(49.66,57.66) v4(50.55,59.18) v4(50.55,58.1) v4(50.55,57.02) v4(51.18,20.77) v4(51.44,58.55) v4(51.44,57.66) v4(54.23,35.12) v4(54.23,33.85) v4(55.24,59.88) v4(55.24,58.61) v4(55.37,35.75) v4(55.37,34.48) v4(55.37,33.21) v4(56.39,60.52) v4(56.39,59.25) v4(56.39,57.98) v4(56.52,35.12) v4(56.52,33.85) v4(57.53,59.88) v4(57.53,58.61) v4(64.68,69.23) v4(64.9,44.26) v4(64.9,42.99) v4(65.91,53.53) v4(65.91,52.26) v4(66.04,44.9) v4(66.04,43.62) v4(66.04,42.36) v4(66.21,70.68) v4(67.06,54.17) v4(67.06,52.9) v4(67.06,51.63) v4(67.18,44.26) v4(67.18,42.99) v4(68.2,53.53) v4(68.2,52.26) v4(71.5,34.61) v4(71.5,33.34) v4(72.64,35.24) v4(72.64,33.97) v4(72.64,32.7) v4(73.79,34.61) v4(73.79,33.34) v4(78.23,55.31) v4(78.23,54.04) v4(79.38,55.94) v4(79.38,54.67) v4(79.38,53.4) v4(80.52,55.31) v4(80.52,54.04) v4(87.12,26.48) v4(87.12,25.21) v4(88.27,27.12) v4(88.27,25.85) v4(88.27,24.58) v4(89.41,26.48) v4(89.41,25.21) v4(92.08,15.05) v4(92.08,13.78) v4(93.22,15.69) v4(93.22,14.42) v4(93.22,13.15) v4(94.36,15.05) v4(94.36,13.78)
VCCBAT: length 12.7
  Top Layer w2.54: CN6.2 22.9,57.2 Q2.2
VCCSERVO: length 25.7
  Top Layer w1.524: 舵机1.2 38.49,70.83 R42.2 38.47,70.18 37.57,69.28 34.93,69.28 31.5,65.85 31.5,58.87 30.1,57.47 L2.2
11: length 6.6
  Top Layer w0.254: U12.1 10.75,32.7 R13.1 R9.2
22: length 7.3
  Top Layer w0.254: R10.2 R14.1 12.51,28 C37.1 10.47,26.16 U13.1
33: length 7.2
  Top Layer w0.254: U14.1 10.64,19.18 10.93,19.18 R15.1 R11.2
44: length 7.6
  Top Layer w0.254: R16.1 R12.2 12.58,14.11 C39.1 10.68,12.32 U15.1
AD7: length 29.2
  Top Layer w0.254: C1.2 35.94,63.5 v4(35.94,64.82) 35.94,67.12 ; v4(28.83,60.64) 21.59,53.4 21.59,51.6 R22.1
  Top Layer w0.762: R22.1 24.76,49.97 R23.1
  Bottom Layer w0.254: v4(35.94,64.82) 33.01,64.82 v4(28.83,60.64)
BGND:
  vias: v3(29.84,2.73) v3(29.84,2.1) v3(30.48,2.73) v3(30.48,2.1) v3(31.12,2.73) v3(31.12,2.1) v3(31.75,2.73) v3(31.75,2.1) v3(32.39,2.73) v3(32.39,2.1) v3(32.7,5.78) v3(33.02,2.73) v3(33.02,2.1) v3(33.66,2.73) v3(33.66,2.1) v3(34.05,5.78) v3(34.29,2.73) v3(34.29,2.1) v3(34.92,2.73) v3(34.92,2.1)
CGND:
  vias: v3(57.4,2.6) v3(57.4,1.97) v3(57.4,1.32) v3(57.4,0.69) v3(58.04,2.6) v3(58.04,1.97) v3(58.04,1.32) v3(58.04,0.69) v3(58.67,2.6) v3(58.67,1.97) v3(58.67,1.32) v3(58.67,0.69) v3(59.31,2.6) v3(59.31,1.97) v3(59.31,1.32) v3(59.31,0.69) v3(59.94,2.6) v3(59.94,1.97) v3(59.94,1.32) v3(59.94,0.69) v3(60.25,5.78) v3(60.58,2.6) v3(60.58,1.97) v3(60.58,1.32) v3(60.58,0.69) v3(61.21,2.6) v3(61.21,1.97) v3(61.21,1.33) v3(61.21,0.7) v3(61.75,5.78) v3(61.85,2.6) v3(61.85,1.97) v3(61.85,1.33) v3(61.85,0.7) v3(62.48,2.6) v3(62.48,1.97) v3(62.48,1.33) v3(62.48,0.7)
FGND:
  vias: v3(33.02,75.38) v3(33.02,74.74) v3(33.02,74.11) v3(33.02,73.47) v3(33.66,75.38) v3(33.66,74.74) v3(33.66,74.11) v3(33.66,73.47) v3(34.29,75.38) v3(34.29,74.74) v3(34.29,74.11) v3(34.29,73.47) v3(35.43,72.2) v3(35.69,75.38) v3(36.07,72.2) v3(36.32,75.38) v3(36.7,72.2) v3(36.96,75.38)
GGND: length 5.9
  Top Layer w0.254: 51.37,51.78 Q1.2
  Top Layer w0.381: v3(50.42,52.73) 51.37,51.78 ; R27.1 49.66,48.32 50.29,48.96 50.29,50.99 50.83,51.53 Q1.2
  vias: v3(49.4,46.36) v3(49.4,45.47) v3(50.29,46.99) v3(50.29,45.91) v3(50.29,44.83) v3(51.18,46.36) v3(51.18,45.47)
GPIO12: length 47.4
  Top Layer w0.254: v3(54.86,44.51) 54.86,44.51 R27.2 ; U8.25 80.16,20.36 v3(79.88,20.64)
  Top Layer w0.635: 51.08,49.88 51.08,48.42
  Bottom Layer w0.254: v3(79.88,20.64) 69.85,30.67 62.1,30.67 56.46,36.31 56.46,42.91 v3(54.86,44.51)
GPIO13: length 75.5
  Top Layer w0.254: v3(15.11,15.91) 15.05,15.98 13.96,15.98 ; v3(60.32,26.87) 74.41,26.87 80.66,20.63 U8.26
  Bottom Layer w0.254: v3(60.32,26.87) 28.08,26.87 17.12,15.91 v3(15.11,15.91)
GPIO14: length 74.6
  Top Layer w0.254: R15.2 15.21,20.8 v3(15.24,20.77) ; v3(60.96,27.5) 74.55,27.5 81.16,20.89 U8.27
  Bottom Layer w0.254: v3(15.24,20.77) 20.57,20.77 27.31,27.5 v3(60.96,27.5)
GPIO15: length 72.8
  Top Layer w0.254: v3(61.6,28.16) 61.62,28.13 74.68,28.13 81.66,21.15 81.66,18.96 U8.28 ; R14.2 14.19,28.13 v3(15.49,28.13)
  Bottom Layer w0.254: v3(15.49,28.13) 61.57,28.13 v3(61.6,28.16)
GPIO16: length 75.2
  Top Layer w0.254: U8.29 82.16,21.41 74.8,28.77 v3(62.23,28.77) ; R13.2 v3(15.37,32.7)
  Bottom Layer w0.254: v3(15.37,32.7) 19.3,28.77 v3(62.23,28.77)
GPIO20: length 92.1
  Top Layer w0.254: v3(62.86,29.4) 74.93,29.4 84.66,19.67 U8.34 ; R5.2 2.92,38.68 v3(2.92,38.61)
  Bottom Layer w0.254: v3(2.92,38.61) 7.81,38.61 8.64,39.43 10.8,39.43 20.83,29.4 v3(62.86,29.4)
GPIO21: length 93.6
  Top Layer w0.254: U8.35 85.16,20.06 75.19,30.03 v3(63.5,30.03) ; v3(2.92,41.96) 2.17,41.2 R6.2
  Bottom Layer w0.254: v3(63.5,30.03) 21.22,30.03 9.29,41.96 v3(2.92,41.96)
GPIO22: length 64.8
  Top Layer w0.254: 70.79,67.7 70.79,67.69 R47.1 ; 70.79,67.7 73.02,65.47 73.02,51.63 77.72,46.93 77.72,29.02 85.66,21.09 U8.36 ; 70.79,67.7 陀螺仪1.4
GPIO23: length 66.3
  Top Layer w0.254: 陀螺仪1.3 v4(71.39,69.64) 73.53,67.5 73.53,51.75 78.23,47.05 78.23,29.15 86.16,21.22 U8.37 ; R48.1 v4(68.96,68.39)
  Bottom Layer w0.254: v4(68.96,68.39) 70.14,68.39 v4(71.39,69.64)
GPIO24: length 61.4
  Top Layer w0.254: U8.38 86.66,21.36 78.74,29.27 78.74,47.18 74.04,51.88 74.04,69.53 陀螺仪1.2
GPIO25: length 60.5
  Top Layer w0.254: U8.39 87.16,21.49 79.25,29.4 79.25,47.31 74.55,52.01 74.55,71.57 陀螺仪1.1
GPIO26: length 62.1
  Top Layer w0.254: 屏幕1.5 88.77,72.2 88.77,69.66 83.69,64.58 83.69,51.12 79.76,47.18 79.76,29.53 87.66,21.63 U8.40
GPIO50: length 14.9
  Top Layer w0.254: 右编码器.4 49.78,5.14 49.78,7.18 47.78,9.18 42.19,9.18 40.83,10.54 CH1.16
GPIO51: length 24.1
  Top Layer w0.254: v3(37.31,9.69) 38.29,10.67 CH1.18
  Bottom Layer w0.254: 左编码器.4 19.05,4.76 26.29,4.76 30.48,8.95 36.58,8.95 v3(37.31,9.69)
GPIO60: length 83.5
  Top Layer w0.254: CH1.21 33.21,17.65 35.81,20.26 44.7,20.26 61.09,36.64 63.6,36.64 v3(70.71,43.75)
  Bottom Layer w0.254: 82.42,73.47 81.15,72.2 81.15,67.25 70.74,56.83 70.74,43.78 v3(70.71,43.75)
GPIO62: length 96.2
  Top Layer w0.254: v3(71.5,42.99) 64.39,35.88 61.47,35.88 45.08,19.5 38.23,19.5 37.14,18.4 37.14,16.25 35.69,14.8 27.19,14.8 25.59,16.39 CH1.27
  Bottom Layer w0.254: 84.96,73.47 83.69,72.2 83.69,68.9 71.5,56.71 v3(71.5,42.99)
GPIO63: length 99
  Top Layer w0.254: v3(45.96,15.03) 46.86,15.94 46.86,18.99 62.23,34.35 65.95,34.35 v3(73.02,41.43) ; CH1.23 30.67,16.38 v3(31.62,15.43)
  Bottom Layer w0.254: v3(31.62,15.43) 32.02,15.03 v3(45.96,15.03) ; 92.58,73.47 91.31,72.2 91.31,70.3 88.77,67.76 84.45,67.76 73.02,56.33 v3(73.02,41.43)
GPIO64: length 17.9
  Top Layer w0.254: CH1.22 33.21,10.67 v3(32.39,9.84)
  Bottom Layer w0.254: v3(32.39,9.84) 29.59,9.84 28.07,8.32 20.07,8.32 左编码器.3
GPIO65: length 2.3
  Top Layer w0.254: R3.1 U10.1
GPIO66: length 2.3
  Top Layer w0.254: R4.1 U10.2
GPIO67: length 20.2
  Top Layer w0.254: CH1.24 30.67,10.67 32.64,8.7 46.23,8.7 右编码器.3
GPIO72: length 2.3
  Top Layer w0.254: 38.12,7.06 35.82,7.06 U10.6
GPIO73: length 2.3
  Top Layer w0.254: U10.5 R1.1
GPIO74: length 82.4
  Top Layer w0.254: CH1.14 43.37,12.07 44.58,13.27 44.58,17.78 61.91,35.12 65.15,35.12 v3(72.26,42.23)
  Bottom Layer w0.254: 屏幕1.7 86.23,72.2 86.23,70.53 72.26,56.56 v3(72.26,42.23)
GPIO75: length 88.4
  Top Layer w0.254: v3(73.79,40.7) 66.67,33.59 62.74,33.59 47.37,18.23 47.37,13.27 45.91,11.81 CH1.12
  Bottom Layer w0.254: v3(73.79,40.7) 73.79,56.2 84.71,67.12 90.68,67.12 93.85,70.3 93.85,72.2 95.12,73.47
GPIO86: length 89.1
  Top Layer w0.254: v3(58.93,68.26) 60.96,68.26 64.39,64.83 69.47,64.83 72.52,61.79 72.52,51.5 77.22,46.8 77.22,28.76 v3(82.99,22.98) ; U8.49 v3(92.16,20.13) ; R24.2 v3(43.43,71.31)
  Bottom Layer w0.254: v3(92.16,20.13) 90.89,21.4 84.57,21.4 v3(82.99,22.98) ; v3(43.43,71.31) 46.48,68.26 v3(58.93,68.26)
GPIO88: length 66.7
  Top Layer w0.254: CH1.4 56.07,12.07 55.12,13.02 55.12,23.56 62.56,31 v3(62.56,31.52) ; R29.2 v3(57.4,71.06)
  Bottom Layer w0.254: v3(62.56,31.52) 62.56,65.9 v3(57.4,71.06)
GPIO89: length 71.2
  Top Layer w0.254: v3(63.25,32.96) 52.45,22.16 52.45,12.89 53.53,11.81 CH1.6 ; R30.2 v3(57.66,73.72)
  Bottom Layer w0.254: v3(57.66,73.72) 63.25,68.14 v3(63.25,32.96)
HGND:
  vias: v3(44.96,75.25) v3(44.96,74.61) v3(44.96,73.98) v3(44.96,73.34) v3(44.96,72.71) v3(44.96,72.07) v3(44.96,71.44) v3(45.59,75.25) v3(45.59,74.61) v3(45.59,73.98) v3(45.59,73.34) v3(45.59,72.71) v3(45.59,72.07) v3(45.59,71.44) v3(46.23,75.25) v3(46.74,69.41) v3(47.37,69.41) v3(48.01,69.41) v3(48.13,74.99)
IGND: length 10.2
  Top Layer w0.762: CH1.2 58.61,10.18 57.51,9.08 53.72,9.08 右编码器.1
RX0: length 26.4
  Top Layer w0.254: U11.6 v4(60.33,22.29) ; v4(53.59,19.24) 53.59,17.12 CH1.5 53.72,16.87 53.72,15.94 v4(54.36,15.3)
  Bottom Layer w0.254: H1.3 61.98,8.57 61.09,8.57 v4(54.36,15.3) ; v4(53.59,19.24) 56.64,22.29 v4(60.33,22.29)
TX0: length 22.8
  Top Layer w0.254: H1.1 64.77,8.32 64.14,8.32 56.07,16.38 CH1.3 56.07,18.54 58.55,21.02 U11.7
UD+: length 18.9
  Top Layer w0.254: v3(74.68,8.83) 74.68,13.65 68.58,19.75 U11.1
  Bottom Layer w0.254: v3(74.68,8.83) 74.68,7.66 USB1.8 74.69,6.78 74.93,6.54 75.44,6.54 75.69,6.79 USB1.6
UD-: length 19.5
  Top Layer w0.254: U11.2 68.45,21.02 75.69,13.78 v3(75.69,8.95)
  Bottom Layer w0.254: USB1.7 75.19,8.58 75.57,8.95 v3(75.69,8.95) 75.82,8.95 76.19,8.59 USB1.5
$1N3242: length 2.7
  Top Layer w0.762: 41.04,73.6 41.66,74.22 R24.1
$1N3276: length 15.4
  Top Layer w1.397: Q2.1 17.84,56.45 12.06,56.45 10.54,54.93 SW1.2
$1N3279: length 11.5
  Top Layer w0.254: 2.1,46.29 1.65,46.29 0.51,45.15 0.51,41.21 1.4,40.32 2.79,40.32 R5.1 R7.2
$1N3280: length 5
  Top Layer w0.254: R8.2 R6.1 3.67,42.49 2.41,43.75 2.1,43.75
$1N3328: length 9.4
  Top Layer w0.762: BUZZER1.2 50.62,54 Q1.3
$1N3332: length 7.3
  Top Layer w0.762: R25.2 54.16,55.46 BUZZER1.1
$1N3334: length 1.6
  Top Layer w0.635: R26.2 49.47,50.04 Q1.1
$1N3368: length 14.6
  Top Layer w0.254: R1.2 40.25,5.14 v3(40.26,5.14) ; v3(50.17,9.72) 50.99,10.54 CH1.8
  Bottom Layer w0.254: v3(40.26,5.14) 43.69,8.57 49.02,8.57 v3(50.17,9.72)
$1N3374: length 11
  Top Layer w0.254: v3(40.34,7.74) 40.31,7.74 R2.2 ; CH1.10 48.45,10.54 v3(47.63,9.72)
  Bottom Layer w0.254: v3(47.63,9.72) 47.12,9.21 41.81,9.21 v3(40.34,7.74)
$1N3379: length 7.2
  Top Layer w0.254: R3.2 27.76,5.33 27.76,10.3 28.13,10.67 CH1.26
$1N3382: length 4.8
  Top Layer w0.254: R4.2 26.93,9.33 25.59,10.67 CH1.28
$1N4050: length 2.3
  Top Layer w0.762: U9.6 52.45,73.72 R30.1
$1N4089: length 2.3
  Top Layer w0.762: R29.1 U9.5
$1N7000: length 2.3
  Bottom Layer w0.254: R44.1 73.69,9.68 USB1.10
$1N7039: length 2.3
  Bottom Layer w0.254: USB1.4 76.69,9.56 R45.1
$1N7189: length 1.8
  Top Layer w0.254: C34.2 61.83,18.02 U11.8
$2N1730: length 1.2
  Top Layer w0.635: R37.2 24.65,42.4 U2.4
$2N1732: length 3.3
  Top Layer w0.635: U2.1 25.42,46.31 26.42,47.31 C33.2
$2N1736: length 1.7
  Top Layer w0.635: R38.1 33.72,44.01 C11.2
$2N1737: length 1.7
  Top Layer w0.635: R38.2 31.98,43.77 U2.6
$2N1738: length 3.4
  Top Layer w0.635: R39.1 35.27,47.46 R40.2
$2N1739: length 9.1
  Top Layer w0.635: U2.5 32.19,42.5 R41.2 32.22,42.48 33.12,41.58 34.66,41.58 35.31,42.23 R40.1
$2N1740: length 4
  Top Layer w0.254: R42.1 33.69,70.8 LED3.2
$2N1741: length 1.7
  Top Layer w0.635: R31.2 34.66,29.55 U1.4
$2N1743: length 3
  Top Layer w0.635: U1.1 35.15,35.02 C32.2
$2N1746: length 1.6
  Top Layer w0.635: R32.1 43.64,32.71 C5.2
$2N1747: length 1.7
  Top Layer w0.635: U1.6 41.91,32.48 R32.2
$2N1748: length 3.3
  Top Layer w0.635: R35.2 R34.1 42.01,31.21 U1.5
$2N1749: length 1.5
  Top Layer w0.254: 20.11,12.2 R36.1
$2N1753: length 3
  Top Layer w0.635: R34.2 44.48,31.09 45.34,31.94 R33.1
$2N1757: length 1.6
  Top Layer w0.254: LED1.2 63.05,70.72 R43.2

## Copper pours and planes (outline as drawn; the poured copper is in the pictures)
3V3 on Top Layer: 48.64,38.89 48.64,42.73 49.66,43.75 50.82,43.75 51.05,43.51 51.05,40.32 50.38,39.65 50.38,39.15 49.86,38.63 48.9,38.63
+5V on Top Layer: 44.5,34.89 44.27,35.12 41.91,35.12 41.52,35.51 41.52,37.16 41.53,37.17 41.53,37.4 41.92,37.79 49.37,37.79 49.62,37.55 49.62,36.17 49.78,36.01 50.55,36.01 50.67,36.13 50.67,37.66 50.8,37.78 51.82,37.78 52.07,37.53 52.07,34.61 51.05,33.59 44.72,33.59 44.5,33.82
AGND on Top Layer: 62.99,25.93 62.99,19.5 62.48,18.99 62.48,17.08 62.23,16.83 60.83,16.83 60.33,16.32 60.33,12.89 64.36,8.85 72.1,8.85 72.53,9.28 72.53,14.53 68.2,18.86 66.16,18.86 65.79,19.23 65.79,25.93
AGND on Bottom Layer: 61.58,26.05 61.58,21.9 59.82,20.13 59.82,13.4 64.26,8.95 69.85,8.95 70.99,10.1 70.99,22.16 67.06,26.1 61.64,26.1
GND on Top Layer: -1.91,76.77 101.6,76.77 101.6,-1.08 -1.91,-1.08
GND on Bottom Layer: -2.79,78.17 102.36,78.17 102.36,-1.71 -2.79,-1.71
VCCBAT on Top Layer: 14.99,50.36 14.99,48.09 17.4,45.67 17.4,36.39 22.35,31.43 26.16,31.43 26.54,31.81 26.54,33.13 22.86,36.82 22.86,38.04 21.72,39.18 21.72,40.96 24,43.24 25.4,43.24 25.4,45.53 24.26,45.53 23.88,45.91 23.88,48.93 23.59,49.22 22.6,49.22 21.08,50.74 15.37,50.74
VCCSERVO on Top Layer: 25.02,53.53 25.02,55.94 29.97,60.9 30.84,60.9 32.39,59.35 32.39,57.21 36.2,53.4 36.2,52.06 35.75,51.61 28.59,51.61 26.8,53.4 25.15,53.4
BGND on Top Layer: 32,7.94 32.39,8.32 34.29,8.32 34.67,7.94 34.67,3.61 35.04,3.24 37.08,3.24 37.34,2.99 37.34,0.7 37.08,0.44 29.34,0.44 29.08,0.7 29.08,2.86 29.46,3.24 31.68,3.24 32,3.57
BGND on Bottom Layer: 32,8.19 34.67,8.19 34.67,3.61 34.92,3.37 36.96,3.37 37.34,2.99 37.34,1.59 37.08,1.33 29.34,1.33 29.08,1.59 29.08,2.86 29.59,3.37 31.8,3.37 32,3.57
CGND on Top Layer: 59.69,7.94 60.07,8.32 61.98,8.32 62.36,7.94 62.36,3.61 62.73,3.24 64.77,3.24 65.02,2.99 65.02,0.57 64.77,0.32 57.02,0.32 56.77,0.57 56.77,2.86 57.15,3.24 59.36,3.24 59.69,3.57
CGND on Bottom Layer: 59.63,7.94 60.01,8.32 61.91,8.32 62.29,7.94 62.29,3.61 62.67,3.24 64.71,3.24 64.96,2.99 64.96,0.7 64.58,0.32 57.09,0.32 56.71,0.7 56.71,2.86 57.09,3.24 59.3,3.24 59.63,3.57
FGND on Top Layer: 32.39,75.61 32.39,72.07 32.77,71.69 37.08,71.69 37.34,71.95 37.34,75.63 37.08,75.88 32.66,75.88
FGND on Bottom Layer: 32.64,75.88 37.08,75.88 37.34,75.63 37.34,71.95 37.08,71.69 32.78,71.69 32.4,72.07 32.39,72.07 32.39,75.63
GGND on Top Layer: 48.58,48.98 48.58,45.08 49.66,44.01 53.34,44.01 53.98,44.64 50.97,47.64 50.29,47.64 50.29,48.98 48.58,48.98
GGND on Bottom Layer: 48.51,45.15 48.51,53.16 49.26,53.91 53.21,53.91 53.98,53.15 53.98,44.64 53.34,44.01 49.66,44.01
HGND on Top Layer: 44.32,75.88 44.32,69.15 44.58,68.9 48.67,68.9 48.67,75.1 47.88,75.88
HGND on Bottom Layer: 44.32,75.88 47.88,75.88 48.64,75.12 48.64,68.89 46.44,68.89 44.31,71.02 44.31,75.87
$1N3250 on Top Layer: 4.57,65.72 4.57,58.74 5.97,57.34 16.64,57.34 17.02,57.72 17.02,60.52 16.51,61.02 11.45,61.02 10.67,61.81 10.67,65.77 4.62,65.77
$1N3275 on Top Layer: 9.27,52.13 12.45,55.31 14.07,55.31 14.3,55.08 14.3,52.59 14.1,52.39 12.52,52.39 8.71,48.58 5.59,48.58 4.57,49.59 4.57,51.15 5.55,52.13
$2N1733 on Top Layer: 26.04,49.21 25.71,49.54 25.71,50.29 26.02,50.6 30.74,50.6 31.5,49.85 31.5,46.26 31.15,45.91 29.84,45.91 27.18,48.58 27.18,48.95 26.92,49.21
$2N1742 on Top Layer: 31.37,38.67 30.48,37.78 30.48,35.89 28.33,33.74 28.33,31.52 29.56,30.29 30.99,30.29 32.82,32.12 35.52,32.12 35.52,34.19 34.2,34.19 33.78,34.61 33.78,35.62 35.05,36.89 35.05,38.37 34.75,38.67
$2N1744 on Top Layer: 36.07,38.04 36.63,37.48 37.64,37.48 37.85,37.28 37.85,36.26 39.5,34.61 41.15,34.61 41.15,38.29 38.99,40.45 36.81,40.45 36.07,39.76
$2N1752 on Top Layer: 36.32,43.88 37.21,44.77 38.48,44.77 41.27,47.56 41.27,48.96 41.78,49.47 45.59,49.47 46.1,48.96 46.1,46.8 44.45,45.15 44.45,40.43 43.6,39.58 40.81,39.58 39.31,41.09 37.21,41.09 36.32,41.97

Small or netless copper shapes (teardrops, artwork), in the pictures only: 185 on Top Layer, 47 on Bottom Layer

## Text on the board
Bottom Silkscreen Layer: Designed By | Loongson
Top Layer: 华侨大学 / 叁佰 / 25.6.22
Top Silkscreen Layer: L | K2 | K3 | K4 | K1 | TX | OFF | ON | Loongson | R | o
